# EAGLE design SingleCtrl (EAGLE 7.6.0)
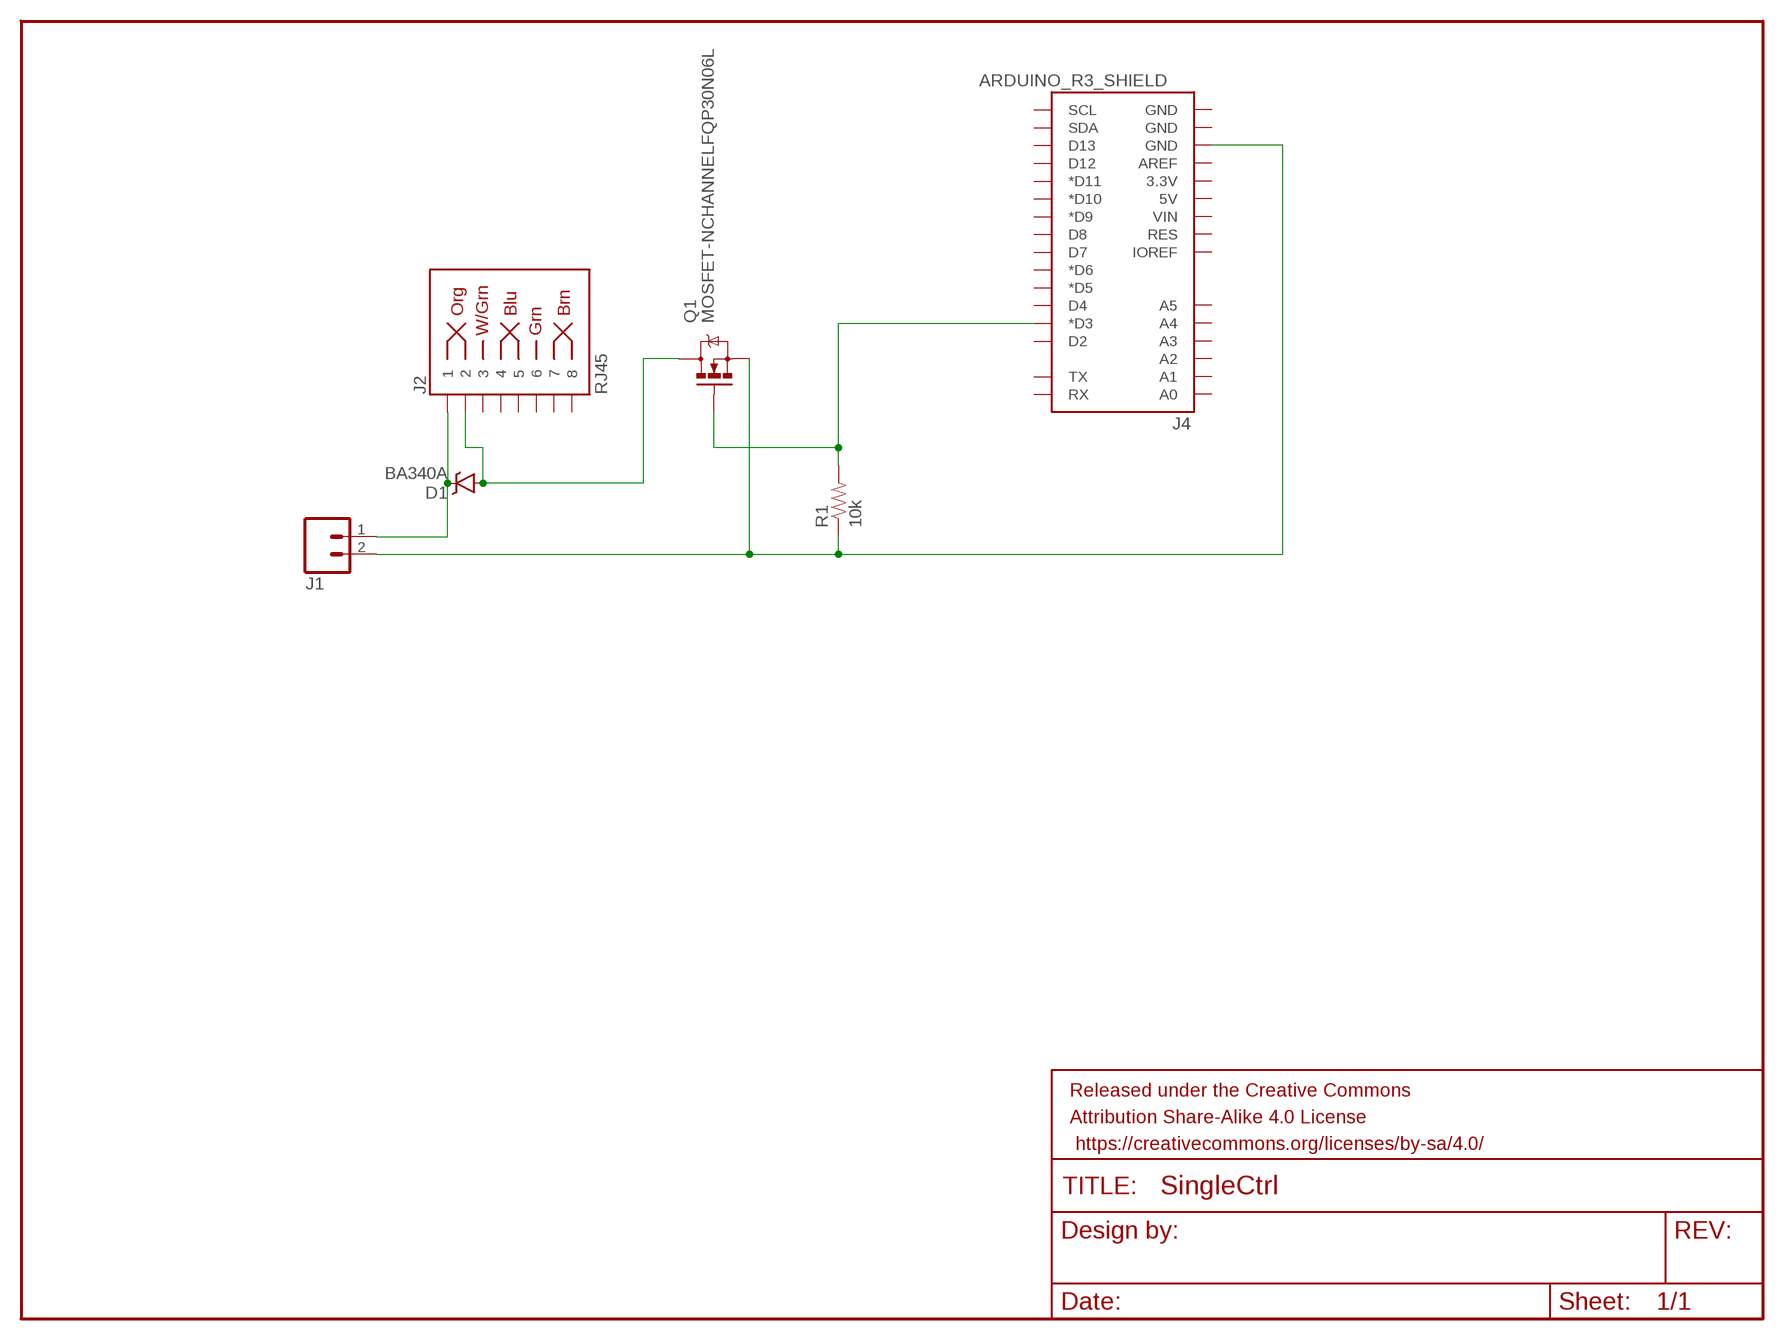
[diagram p0: schematic, sheet 1]

## Parts
D1  BA340A  B340A  [SMA-DIODE]
FRAME1  FRAME-LETTER  [CREATIVE_COMMONS]
J1  M02JST-PTH-2  [JST-2-PTH]
J2  RJ45  RJ45-8PTH  [RJ45-8]
J4  ARDUINO_R3_SHIELD  [UNO_R3_SHIELD]
Q1  MOSFET-NCHANNELFQP30N06L  [TO220V]
R1  10k  10KOHM-1/4W-1%(PTH)HORIZ  [AXIAL-0.3]

## Nets
N$1: D1.C J1.1 J2.1
N$2: D1.A J2.2 Q1.2(D)
N$3: J1.2 J4.GND@2(GND) Q1.3(S) R1.P$1
N$4: J4.D3(*D3) Q1.1(G) R1.P$2
Unconnected: J2.3 J2.4 J2.5 J2.6 J2.7 J2.8 J4.3.3V J4.5V J4.A0 J4.A1 J4.A2 J4.A3 J4.A4 J4.A5 J4.AREF J4.D2 J4.D4 J4.D5(*D5) J4.D6(*D6) J4.D7 J4.D8 J4.D9(*D9) J4.D10(*D10) J4.D11(*D11) J4.D12 J4.D13 J4.GND@0(GND) J4.GND@1(GND) J4.IOREF J4.RES J4.RX J4.SCL J4.SDA J4.TX J4.VIN

## Library data of the parts
D1 = SparkFun-DiscreteSemi:B340A: Schottky Diode 3A-40V; PROD_ID: DIO-09886
FRAME1 = SparkFun-Aesthetics:FRAME-LETTER: Schematic Frame Standard 8.5x11 US Letter frame
J1 = SparkFun-Connectors:M02: Standard 2-pin 0.1" header. Use with - straight break away headers ( PRT-00116) - right angle break away headers (PRT-00553) - swiss pins (PRT-00743) - machine pins (PRT-00117) - female headers (PRT-00115) Molex polarized connector foot print use with: PRT-08233 with associated crimp pins and housings. 2.54_SCREWTERM for use with PRT-10571. 3.5mm Screw Terminal footprints for PRT-08084 5mm Screw Terminal footprints for use with PRT-08432; PROD_ID: CONN-09863; SKU: PRT-09914
J2 = SparkFun-Connectors:RJ45-8: RJ45 Jack Simple RJ45, 8-pin connection - connector for common Cat5, Cat5e, and Cat6 Ethernet cables. Footprint not yet proven in production. Connector sku is PRT-00643; Breakout PCB sku is BOB-00716.; PROD_ID: CONN-08506
J4 = SparkFun-Boards:ARDUINO_R3_SHIELD: Shield form compatible with the Arduino Uno R3.
Q1 = SparkFun-DiscreteSemi:MOSFET-NCHANNEL: Common NMOSFET Parts MFG P/N Store ID Prod ID FDD8780 TRANS-09984 SI7820DN TRANS-11055 FDS6630A IC-08089 2N7002PW TRANS-11151 FQP30N06L COM-10213 TRANS-10060 BSS123LT1G TRANS-08345 BSS138 TRANS-00830 BS170 2N7000; PROD_ID: TRANS-10060
R1 = SparkFun-Resistors:10KOHM-1/4W-1%(PTH): RES-12183; PROD_ID: RES-12183

## Board
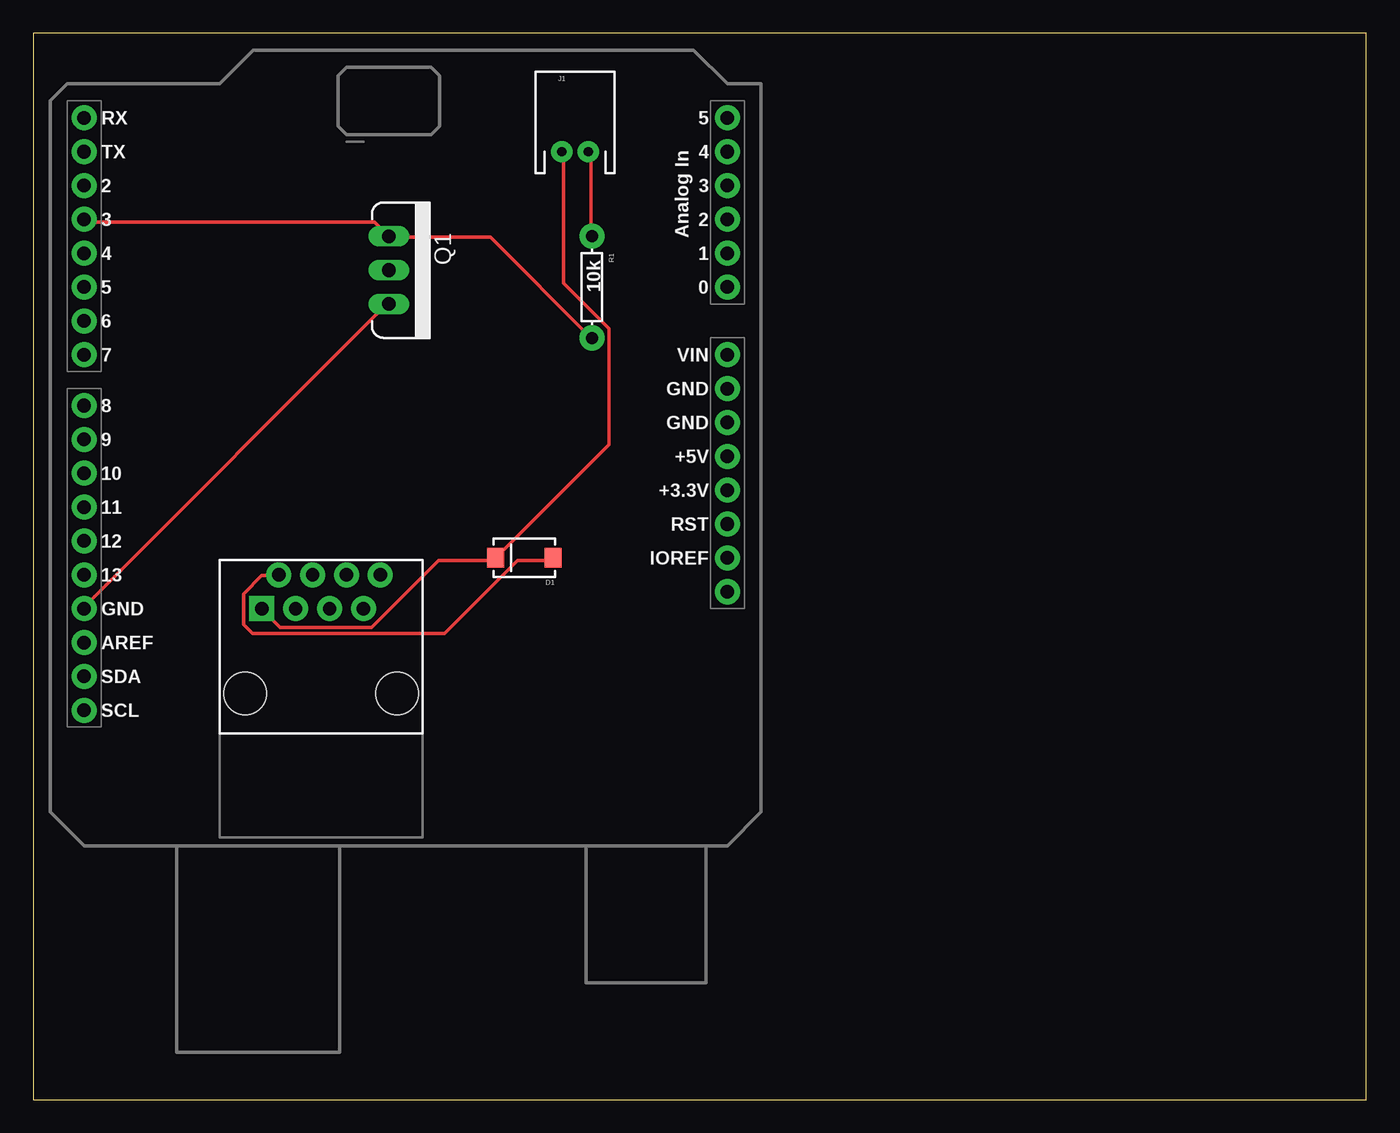
[diagram p1: board, top side]
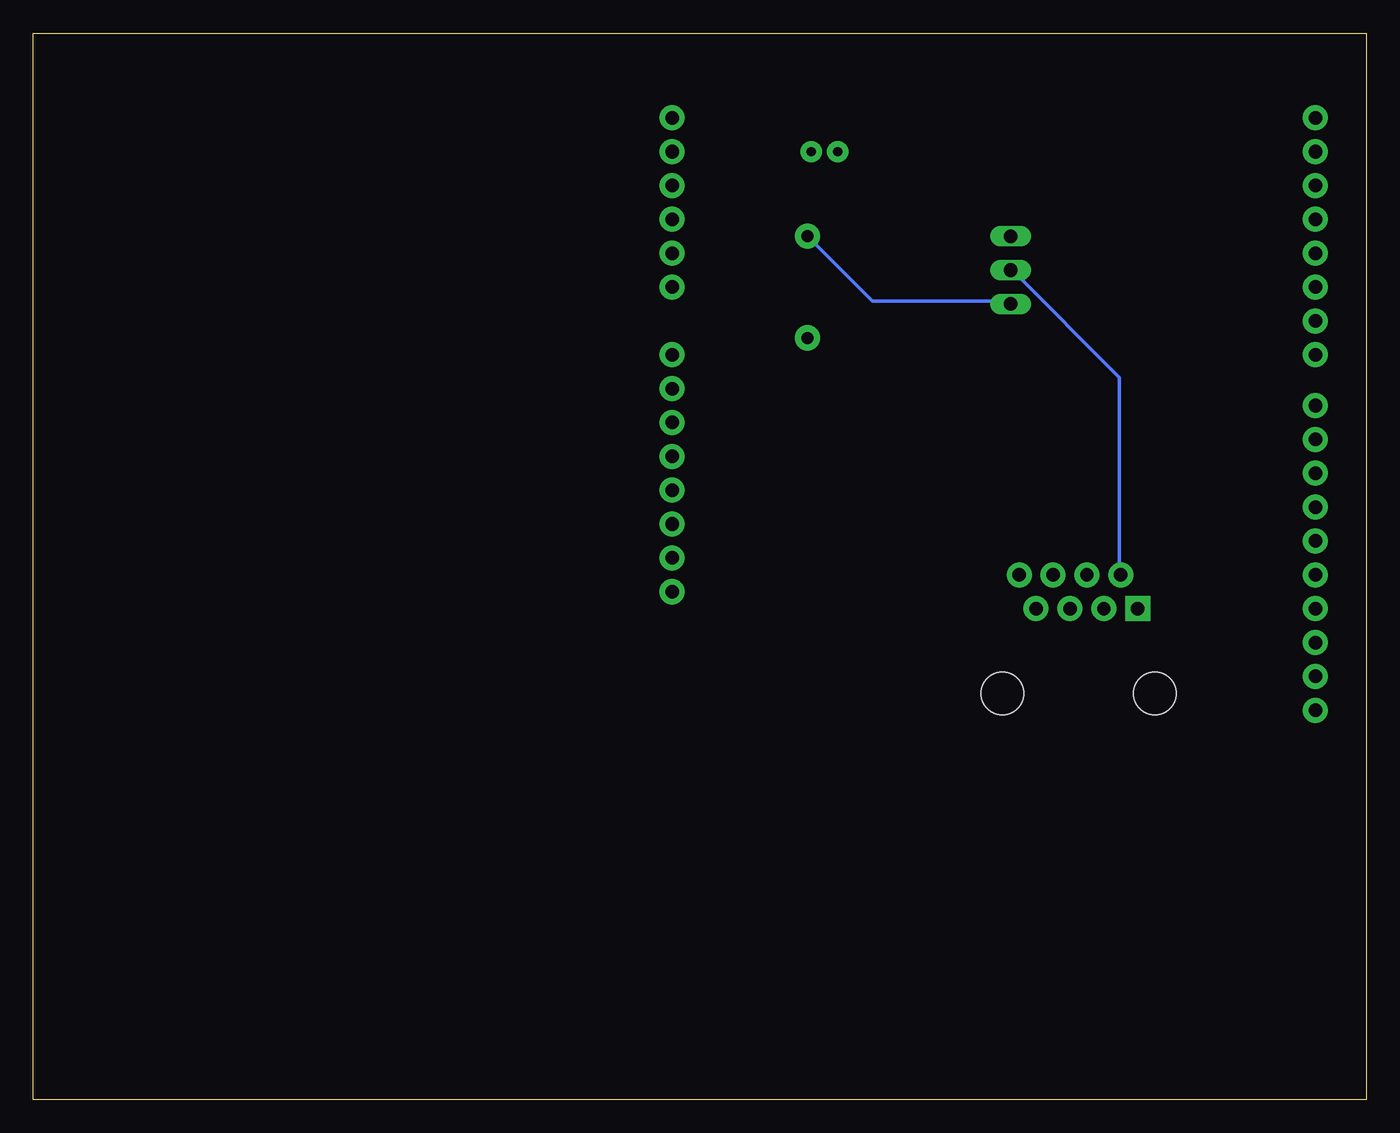
[diagram p2: board, bottom side, seen from below]

Size 100 x 80 mm. Coordinates in mm from the lower left corner, seen from the top.
Outline: 0,0 100,0 100,80 0,80 0,0
Copper layers (1*16): Top 0.035mm / dielectric 1.5mm / Bottom 0.035mm
Design rules "default": minimum track width 10mil, minimum drill 24mil, track to track 8mil, track to pad 8mil, pad to pad 8mil, via to via 8mil, smd to smd 8mil, copper to edge 40mil, drill to drill 8mil, minimum pad ring 10mil, minimum via ring 8mil, stop-mask expansion 4mil, vias tented up to drill 0mil, thermal gap 10mil

### Footprints (pad centres in the part's own frame; a part is rotated, then mirrored left to right if it is on the bottom)
SMA-DIODE = smd 1.27 x 1.47: A -2.15,0; C 2.15,0
JST-2-PTH = drill 0.7 pad 1.6: 1 -1,0; 2 1,0
RJ45-8 = drill 1 pad 1.88 square: 1 -4.445,6.35 | drill 1 pad 1.88: 2 -3.175,8.89; 3 -1.905,6.35; 4 -0.635,8.89; 5 0.635,6.35; 6 1.905,8.89; 7 3.175,6.35; 8 4.445,8.89 | hole 3.2: -5.715,0; 5.715,0
UNO_R3_SHIELD = drill 1.016 pad 1.88: 3.3V 50.8,26.67; 5V 50.8,29.21; A0 50.8,41.91; A1 50.8,44.45; A2 50.8,46.99; A3 50.8,49.53; A4 50.8,52.07; A5 50.8,54.61; AREF 2.54,15.24; D2 2.54,49.53; D3 2.54,46.99; D4 2.54,44.45; D5 2.54,41.91; D6 2.54,39.37; D7 2.54,36.83; D8 2.54,33.02; D9 2.54,30.48; D10 2.54,27.94; D11 2.54,25.4; D12 2.54,22.86; D13 2.54,20.32; GND@0 50.8,31.75; GND@1 50.8,34.29; GND@2 2.54,17.78; IOREF 50.8,21.59; NC 50.8,19.05; RES 50.8,24.13; RX 2.54,54.61; SCL 2.54,10.16; SDA 2.54,12.7; TX 2.54,52.07; VIN 50.8,36.83
TO220V = drill 1.016 long: 1 -2.54,0; 2 0,0; 3 2.54,0
AXIAL-0.3 = drill 0.9 pad 1.88: P$1 -3.81,0; P$2 3.81,0

### Placement (x,y rotation side)
D1  36.83,40.64 180 top
FRAME1  -101.6,87.63 0 top  (outside the outline)
J1  40.64,71.12 0 top
J2  21.59,30.48 0 top
J4  1.27,19.05 0 top
Q1  26.67,62.23 270 top
R1  41.91,60.96 270 top

### Tracks (layer width: path | path; a pad name or v marks a point on that pad's centre or on a via)
N$1
  Top 0.254: J2.1 17.14,36.8 18.52,35.43 25.38,35.43 30.4,40.46 34.52,40.46 D1.C 34.75,40.69 43.2,49.15 43.2,57.84 39.78,61.27 39.78,71.09 J1.1
N$2
  Top 0.254: D1.A 38.86,40.46 36.35,40.46 30.86,34.98 16.46,34.98 15.77,35.66 15.77,37.95 17.14,39.32 18.29,39.32 J2.2
  Bottom 0.254: Q1.2 26.52,62.18 18.52,54.18 18.52,39.55 J2.2
N$3
  Top 0.254: J1.2 41.83,71.09 41.83,64.92 R1.P$1 | J4.GND@2 3.89,37.03 26.52,59.66 Q1.3
  Bottom 0.254: R1.P$1 37.03,59.89 26.75,59.89 Q1.3
N$4
  Top 0.254: R1.P$2 41.83,57.15 34.29,64.69 26.75,64.69 Q1.1 25.6,65.84 3.89,65.84 J4.D3